# EAGLE design TI_ESP_PCB (EAGLE 9.6.2)
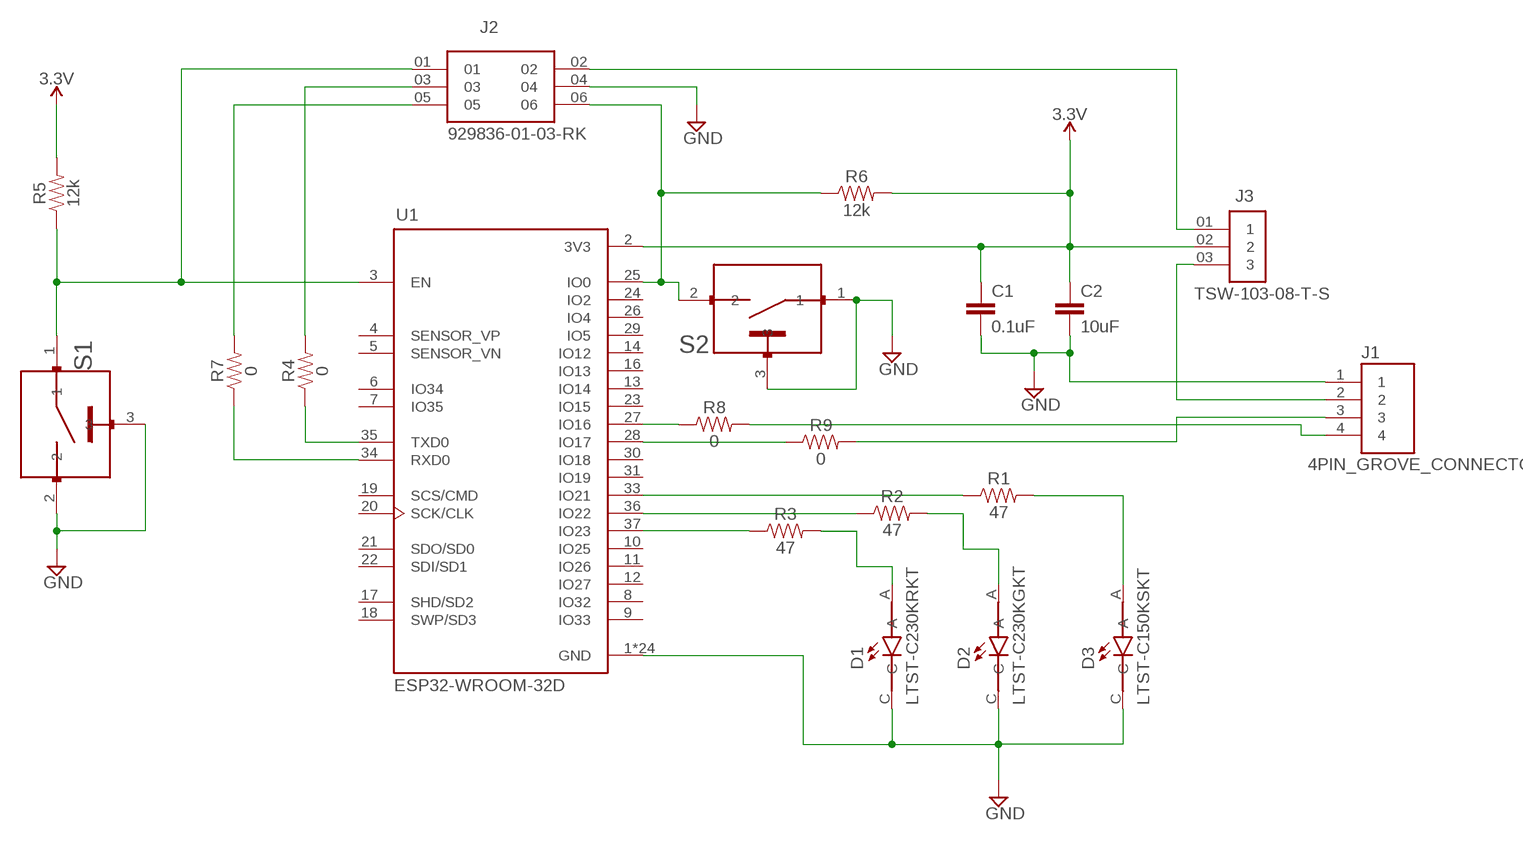
[diagram p0: schematic, sheet 1]

## Parts
C1  0.1uF  0.1UF-1206  [1206]
C2  10uF  10UF-1206  [1206]
D1  LTST-C230KRKT  [LEDC3216X110]
D2  LTST-C230KGKT  [LEDC3216X110]
D3  LTST-C150KSKT  [LEDC3216X110]
J1  4PIN_GROVE_CONNECTOR  [SEEED_114020163]
J2  929836-01-03-RK  [3M-2X3_6PIN_CONNECTOR]
J3  TSW-103-08-T-S  [SAMTEC_TSW-103-08-T-S]
R1  47  47OHM  [1206]
R2  47  47OHM  [1206]
R3  47  47OHM  [1206]
R4  0  470OHM  [1206]
R5  12k  12KOHM  [1206]
R6  12k  12KOHM  [1206]
R7  0  470OHM  [1206]
R8  0  470OHM  [1206]
R9  0  470OHM  [1206]
S1  B3U-1100P  [SW_B3U-1100P]
S2  B3U-1100P  [SW_B3U-1100P]
U1  ESP32-WROOM-32D  [MODULE_ESP32-WROOM-32D]

## Nets
3.3V [PWR]: C1.1 C2.1 J3.02 R5.2 R6.2 U1.2(3V3)
EN: J2.01 R5.1 S1.1 U1.3(EN)
GND: C1.2 C2.2 D1.C D2.C D3.C J1.1 J2.04 S1.2 S1.3 S2.1 S2.3 U1.1(GND) U1.15(GND) U1.38(GND) U1.39_1(GND) U1.39_2(GND) U1.39_3(GND) U1.39_4(GND) U1.39_5(GND) U1.39_6(GND) U1.39_7(GND) U1.39_8(GND) U1.39_9(GND) U1.39_10(GND) U1.39_11(GND) U1.39_12(GND) U1.39_13(GND) U1.39_14(GND) U1.39_15(GND) U1.39_16(GND) U1.39_17(GND) U1.39_18(GND) U1.39_19(GND) U1.39_20(GND) U1.39_21(GND)
IO0: J2.06 R6.1 S2.2 U1.25(IO0)
IO16: R8.1 U1.27(IO16)
IO17: R9.1 U1.28(IO17)
IO21: R1.1 U1.33(IO21)
IO22: R2.1 U1.36(IO22)
IO23: R3.1 U1.37(IO23)
N$2: J2.03 R4.2
N$5: J1.2 J3.03
N$6: J2.02 J3.01
N$7: D1.A R3.2
N$8: D2.A R2.2
N$9: D3.A R1.2
N$13: J1.4 R8.2
N$16: J1.3 R9.2
N$18: J2.05 R7.2
RXD0: R7.1 U1.34(RXD0)
TXD0: R4.1 U1.35(TXD0)
Unconnected: U1.4(SENSOR_VP) U1.5(SENSOR_VN) U1.6(IO34) U1.7(IO35) U1.8(IO32) U1.9(IO33) U1.10(IO25) U1.11(IO26) U1.12(IO27) U1.13(IO14) U1.14(IO12) U1.16(IO13) U1.17(SHD/SD2) U1.18(SWP/SD3) U1.19(SCS/CMD) U1.20(SCK/CLK) U1.21(SDO/SD0) U1.22(SDI/SD1) U1.23(IO15) U1.24(IO2) U1.26(IO4) U1.29(IO5) U1.30(IO18) U1.31(IO19)

## Library data of the parts
C1 = MyLib_06_14:0.1UF: 0.1uF ceramic capacitors A capacitor is a passive two-terminal electrical component used to store electrical energy temporarily in an electric field.
C2 = MyLib_06_14:10UF: 10uF ceramic capacitors A capacitor is a passive two-terminal electrical component used to store electrical energy temporarily in an electric field.
D1 = LTST-C230KRKT:LTST-C230KRKT: LED SMT RED CLR 1206 TAPE Check prices <https://pricing.snapeda.com/parts/LTST-C230KRKT/Lite-On%20Inc./view-part?ref=eda>; AVAILABILITY: In Stock; DESCRIPTION: Red 631nm LED Indication - Discrete 2V 1206 (3216 Metric); MF: Lite-On Inc.; MP: LTST-C230KRKT; PACKAGE: 1206 Lite-On; PRICE: None; PURCHASE-URL: https://pricing.snapeda.com/search/part/LTST-C230KRKT/?ref=eda
D2 = LTST-C230KRKT:LTST-C230KGKT: LED SMT GREEN CLR 1206 TAPE Check prices <https://pricing.snapeda.com/parts/LTST-C230KRKT/Lite-On%20Inc./view-part?ref=eda>; AVAILABILITY: In Stock; DESCRIPTION: Green 571nm LED Indication - Discrete 2V 1206 (3216 Metric); MF: Lite-On Inc.; MP: LTST-C230KGKT; PACKAGE: 1206 Lite-On; PRICE: $0.31; PURCHASE-URL: https://pricing.snapeda.com/search/part/LTST-C230KRKT/?ref=eda
D3 = LTST-C230KRKT:LTST-C150KSKT: LED SMT YELLOW CLR 1206 TAPE Check prices <https://pricing.snapeda.com/parts/LTST-C230KRKT/Lite-On%20Inc./view-part?ref=eda>; AVAILABILITY: In Stock; DESCRIPTION: Yellow 591nm LED Indication - Discrete 2.1V 1206 (3216 Metric); MF: Lite-On Inc.; MP: LTST-C150KSKT; PACKAGE: 1206 Lite-On; PRICE: $0.35; PURCHASE-URL: https://pricing.snapeda.com/search/part/LTST-C230KRKT/?ref=eda
J1 = MyLib_06_14:4PIN_GROVE_CONNECTOR: Check prices <https://pricing.snapeda.com/parts/110990030/Seeed%20Technology%20Co.%2C%20Ltd/view-part?ref=eda> GROVE 2MM 4PIN VERT CONN 10PCS; AVAILABILITY: In Stock; DESCRIPTION: GROVE 2MM 4PIN VERT CONN 10PCS; MF: Seeed Technology Co., Ltd; MP: 110990030; PACKAGE: None; PRICE: None; PURCHASE-URL: https://pricing.snapeda.com/search/part/110990030/?ref=eda
J2 = MyLib_06_14:929836-01-03-RK: Check prices <https://pricing.snapeda.com/parts/TSW-103-23-G-D/Samtec/view-part?ref=eda> 2X3 6 PIN CONNECTOR; DESCRIPTION: CONN HEADER VERT 6POS 2.54MM; MF: 3M; MP: 929836-01-03-RK; PACKAGE: None; PRICE: None; PURCHASE-URL: https://www.digikey.com/en/products/detail/3m/929836-01-03-rk/2184030
J3 = TSW-103-08-T-S:TSW-103-08-T-S: Check prices <https://pricing.snapeda.com/parts/TSW-103-08-T-S/Samtec%20Inc./view-part?ref=eda>; AVAILABILITY: In Stock; DESCRIPTION: TSW - Samtec 2.54mm Pin Header 13.46mm Overall Pin Length 5.08mm Tail (08) - Fast Stock; MF: Samtec Inc.; MP: TSW-103-08-T-S; PACKAGE: None; PRICE: None; PURCHASE-URL: https://pricing.snapeda.com/search/part/TSW-103-08-T-S/?ref=eda
R1-R3 = MyLib_06_14:47OHM: 47Ω resistor A resistor is a passive two-terminal electrical component that implements electrical resistance as a circuit element. Resistors act to reduce current flow, and, at the same time, act to lower voltage levels within circuits. - Wikipedia
R4 R7-R9 = MyLib_06_14:470OHM: 470Ω resistor A resistor is a passive two-terminal electrical component that implements electrical resistance as a circuit element. Resistors act to reduce current flow, and, at the same time, act to lower voltage levels within circuits. - Wikipedia; VALUE: 470
R5 R6 = MyLib_06_14:12KOHM: 12kΩ resistor A resistor is a passive two-terminal electrical component that implements electrical resistance as a circuit element. Resistors act to reduce current flow, and, at the same time, act to lower voltage levels within circuits. - Wikipedia
S1 S2 = B3U-1100P:B3U-1100P: Ultra-small Surface-mounting Tactile Switches with High Contact Reliability Check prices <https://pricing.snapeda.com/parts/B3U-1100P/Omron/view-part?ref=eda>; AVAILABILITY: In Stock; DESCRIPTION: Tactile Switch SPST-NO Top Actuated Surface Mount; MF: Omron; MP: B3U-1100P; PACKAGE: Custom Package Omron; PRICE: None; PURCHASE-URL: https://pricing.snapeda.com/search/part/B3U-1100P/?ref=eda
U1 = ESP32-WROOM-32D:ESP32-WROOM-32D: Bluetooth, WiFi 802.11b/g/n, Bluetooth v4.2 + EDR, Class 1, 2 and 3 Transceiver Module 2.4GHz ~ 2.5GHz Integrated, Trace Surface Mount Check prices <https://pricing.snapeda.com/parts/ESP32-WROOM-32D/Espressif%20Systems/view-part?ref=eda>; AVAILABILITY: In Stock; DESCRIPTION: Bluetooth, WiFi 802.11b/g/n, Bluetooth v4.2 +EDR, Class 1, 2 and 3 Transceiver Module 2.4GHz ~ 2.5GHz Integrated; MF: Espressif Systems; MP: ESP32-WROOM-32D; PACKAGE: Module Espressif Systems; PRICE: None; PURCHASE-URL: https://pricing.snapeda.com/search/part/ESP32-WROOM-32D/?ref=eda

## Net classes
1 PWR: clearance 0.305 mm

## Board
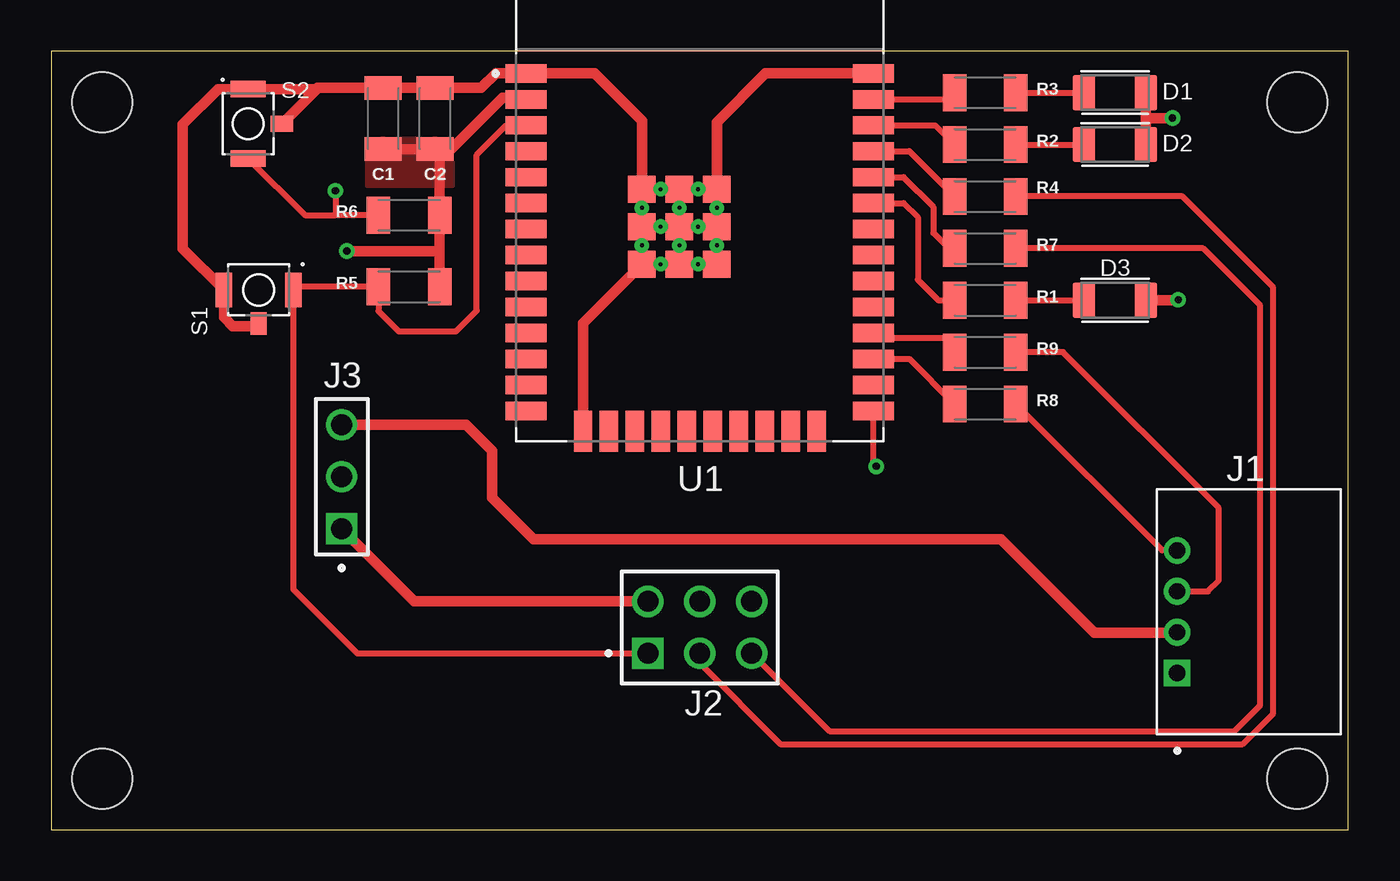
[diagram p1: board, top side]
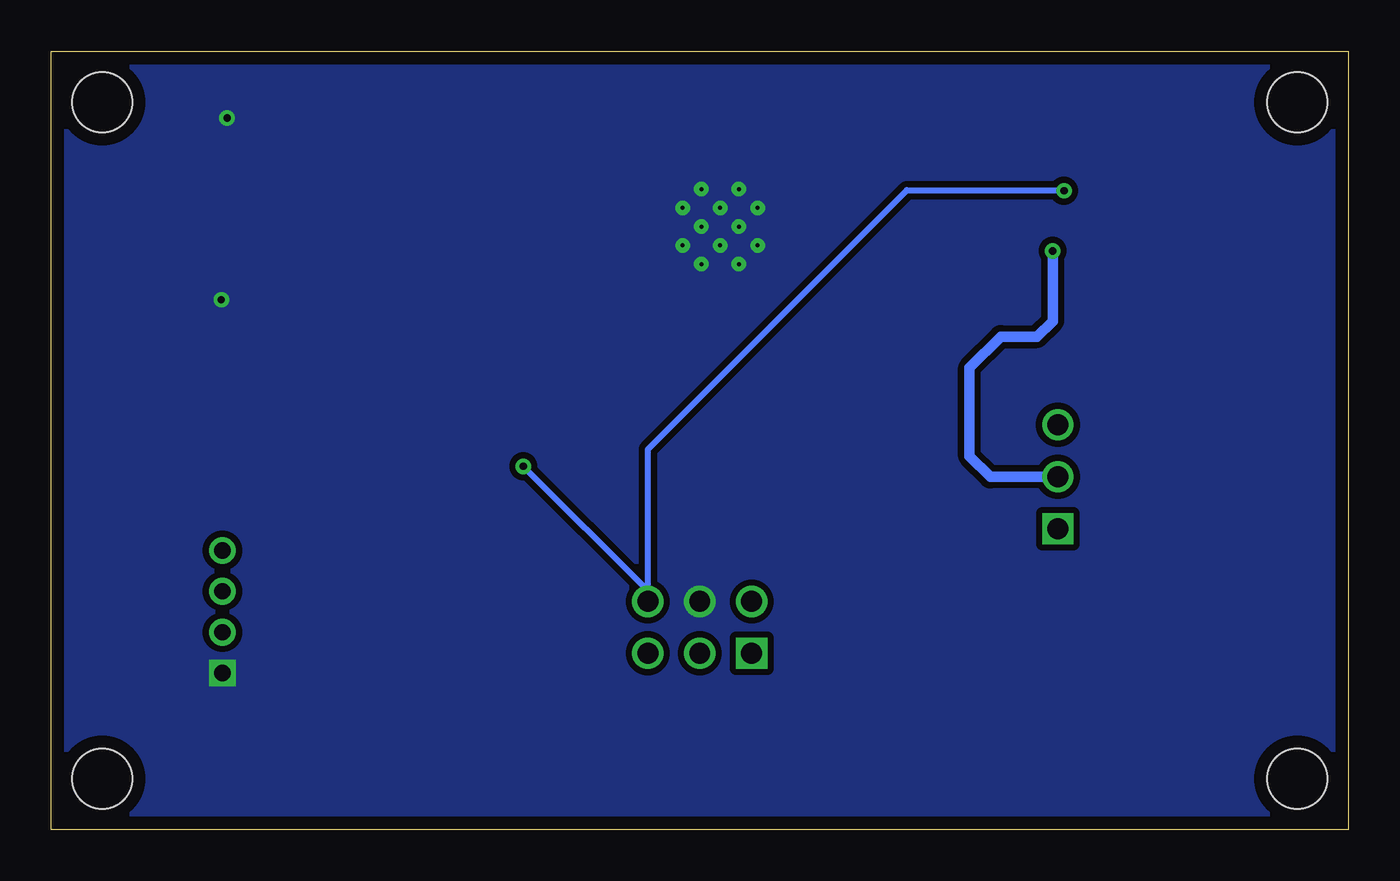
[diagram p2: board, bottom side, seen from below]

Size 63.5 x 38.1 mm. Coordinates in mm from the lower left corner, seen from the top.
Outline: 0,0 63.5,0 63.5,38.1 0,38.1 0,0
Copper layers (1*16): Top 0.035mm / dielectric 1.5mm / Bottom 0.035mm
Design rules "default *": minimum track width 6mil, minimum drill 0.2mm, track to track 12mil, track to pad 12mil, pad to pad 6mil, via to via 6mil, smd to smd 0mil, copper to edge 25mil, drill to drill 25mil, minimum pad ring 10mil, minimum via ring 8mil, stop-mask expansion 4mil, vias tented up to drill 0mil, thermal gap 0mil
Holes 2.95 mm at 2.5,35.6 61,35.6 2.5,2.5 61,2.5

### Footprints (pad centres in the part's own frame; a part is rotated, then mirrored left to right if it is on the bottom)
1206 = smd 1.15 x 1.8: 1 -1.5,0; 2 1.5,0
LEDC3216X110 = smd 1.1 x 1.73: A 1.51,0; C -1.51,0
SEEED_114020163 = drill 0.8 square: 1 -3,0 | drill 0.8: 2 -1,0; 3 1,0; 4 3,0
3M-2X3_6PIN_CONNECTOR = drill 1.02 pad 1.37 square: 01 0,0 | drill 1.02 pad 1.37: 02 0,2.54; 03 2.54,0; 04 2.54,2.54; 05 5.08,0; 06 5.08,2.54
SAMTEC_TSW-103-08-T-S = drill 1.02 pad 1.37 square: 01 0,0 | drill 1.02 pad 1.37: 02 2.54,0; 03 5.08,0
SW_B3U-1100P = smd 0.8 x 1.7: 1 1.7,0; 2 -1.7,0 | smd 0.8 x 1.1: 3 0,-1.65
MODULE_ESP32-WROOM-32D = smd 2 x 0.9: 1 -8.5,5.26; 2 -8.5,3.99; 3 -8.5,2.72; 4 -8.5,1.45; 5 -8.5,0.18; 6 -8.5,-1.09; 7 -8.5,-2.36; 8 -8.5,-3.63; 9 -8.5,-4.9; 10 -8.5,-6.17; 11 -8.5,-7.44; 12 -8.5,-8.71; 13 -8.5,-9.98; 14 -8.5,-11.25; 25 8.5,-11.25; 26 8.5,-9.98; 27 8.5,-8.71; 28 8.5,-7.44; 29 8.5,-6.17; 30 8.5,-4.9; 31 8.5,-3.63; 32 8.5,-2.36; 33 8.5,-1.09; 34 8.5,0.18; 35 8.5,1.45; 36 8.5,2.72; 37 8.5,3.99; 38 8.5,5.26 | smd 0.9 x 2: 15 -5.715,-12.25; 16 -4.445,-12.25; 17 -3.175,-12.25; 18 -1.905,-12.25; 19 -0.635,-12.25; 20 0.635,-12.25; 21 1.905,-12.25; 22 3.175,-12.25; 23 4.445,-12.25; 24 5.715,-12.25 | smd 1.33 x 1.33: 39_1 -2.835,-0.405; 39_2 -1,-0.405; 39_3 0.835,-0.405; 39_4 -2.835,-2.24; 39_5 -1,-2.24; 39_6 0.835,-2.24; 39_7 -2.835,-4.075; 39_8 -1,-4.075; 39_9 0.835,-4.075 | drill 0.2 pad 0.3: 39_10 -1.917,-0.405; 39_11 -0.083,-0.405; 39_12 -2.835,-1.323; 39_13 -1,-1.323; 39_14 0.835,-1.323; 39_15 -1.917,-2.24; 39_16 -0.083,-2.24; 39_17 -2.835,-3.158; 39_18 -1,-3.158; 39_19 0.835,-3.158; 39_20 -1.917,-4.075; 39_21 -0.083,-4.075

### Placement (x,y rotation side)
C1  16.26,34.8 90 top
C2  18.8,34.8 90 top
D1  52.07,36.07 180 top
D2  52.07,33.53 180 top
D3  52.07,25.91 180 top
J1  55.12,10.67 90 top
J2  29.21,8.64 0 top
J3  14.22,14.73 90 top
R1  45.72,25.91 0 top
R2  45.72,33.53 0 top
R3  45.72,36.07 0 top
R4  45.72,30.99 0 top
R5  17.53,26.57 0 top
R6  17.53,30.07 0 top
R7  45.72,28.45 0 top
R8  45.72,20.83 0 top
R9  45.72,23.37 0 top
S1  10.16,26.42 0 top
S2  9.65,34.54 90 top
U1  31.75,31.75 0 top

### Tracks (layer width: path | path; a pad name or v marks a point on that pad's centre or on a via)
3.3V  (via drill 0.35)
  Top 0.508: C1.1 C2.1 | C2.1 19.03,33.07 R6.2 19.03,28.31 | 19.03,28.31 R5.2 | C2.1 19.58,33.3 22.1,35.81 23.18,35.81 U1.2 | v14.48,28.32 v14.49,28.31 19.03,28.31
  Bottom 0.508: v14.48,28.32 14.48,24.89 15.24,24.13 17.02,24.13 18.54,22.61 18.54,18.29 17.53,17.27 J3.02
  pour Top: 15.44,33.81 15.44,31.52 19.68,31.52 19.68,33.78 19.71,33.81
  pour Top: 16,32.08 16,33.15 16,33.22 19.08,33.22 19.08,32.54 19.05,32.56 19.02,32.59 16.18,32.59
  pour Top: 16.76,33.55 18.08,33.55 18.08,33.27
EN
  Top 0.305: U1.3 22.28,34.47 20.83,33.02 20.83,25.4 19.81,24.38 17.02,24.38 16.03,25.38 R5.1 12.01,26.57 S1.1 11.86,11.76 14.99,8.64 J2.01
GND  (via drill 0.35)
  Top 0.305: 13,36.24 13.06,36.3 | 10.03,24.64 S1.3 | U1.39_1 U1.39_12 U1.39_4 | U1.39_2 U1.39_13 | U1.39_3 U1.39_14 U1.39_6 | U1.39_15 U1.39_5 | U1.39_8 U1.39_20 U1.39_7 | U1.39_21 U1.39_9
  Top 0.508: 13.06,36.3 C1.2 C2.2 21.06,36.3 21.77,37.01 U1.1 26.59,37.01 28.91,34.69 U1.39_1 | S2.3 13,36.24 S2.1 8.18,36.24 6.45,34.52 6.45,28.42 S1.2 8.46,25.07 8.89,24.64 10.03,24.64 | U1.39_3 32.59,34.62 34.98,37.01 U1.38 | U1.39_7 26.04,24.8 U1.15 | D1.C 53.58,34.8 | 53.58,34.8 D2.C | 53.58,34.8 53.6,34.82 v54.89,34.82 | D3.C 55.14,25.91 v55.17,25.93
  pour Bottom: 0,38.1 0,0 63.75,0 63.75,37.85 63.5,38.1
IO0  (via drill 0.35)
  Top 0.305: S2.2 12.42,30.07 13.92,30.07 | v40.39,17.78 40.25,17.92 U1.25 | v13.92,31.27 13.92,30.07 | R6.1 13.92,30.07
  Bottom 0.305: v40.39,17.78 34.29,11.68 J2.06 34.29,18.62 21.61,31.29 13.95,31.29 v13.92,31.27
IO16
  Top 0.305: U1.27 42.01,23.04 R8.1
IO17
  Top 0.305: U1.28 40.5,24.06 43.79,24.06 44.22,23.62 R9.1
IO21
  Top 0.305: U1.33 41.73,30.66 42.42,29.97 42.42,26.92 43.43,25.91 R1.1
IO22
  Top 0.305: U1.36 43.28,34.47 R2.1
IO23
  Top 0.305: U1.37 43.89,35.74 R3.1
N$2
  Top 0.305: J2.03 31.75,8.14 35.7,4.19 58.33,4.19 59.82,5.68 59.82,26.54 55.37,30.99 R4.2
N$5
  Top 0.508: J3.03 20.32,19.81 21.59,18.54 21.59,16.26 23.62,14.22 46.48,14.22 51.05,9.65 55.1,9.65 J1.2
N$6
  Top 0.508: J3.01 17.78,11.18 J2.02
N$7
  Top 0.305: R3.2 D1.A
N$8
  Top 0.305: R2.2 D2.A
N$9
  Top 0.305: R1.2 D3.A
N$13
  Top 0.305: J1.4 54.38,13.67 R8.2
N$16
  Top 0.305: J1.3 56.63,11.67 57.15,12.19 57.15,15.75 49.53,23.37 R9.2
N$18
  Top 0.305: J2.05 38.1,4.83 57.91,4.83 59.18,6.1 59.18,25.65 56.39,28.45 R7.2
RXD0
  Top 0.305: U1.34 41.73,31.93 43.18,30.48 43.18,29.21 43.94,28.45 R7.1
TXD0
  Top 0.305: U1.35 42.01,33.2 R4.1